# EAGLE design I2C Spilter Board (EAGLE 7.1.0)
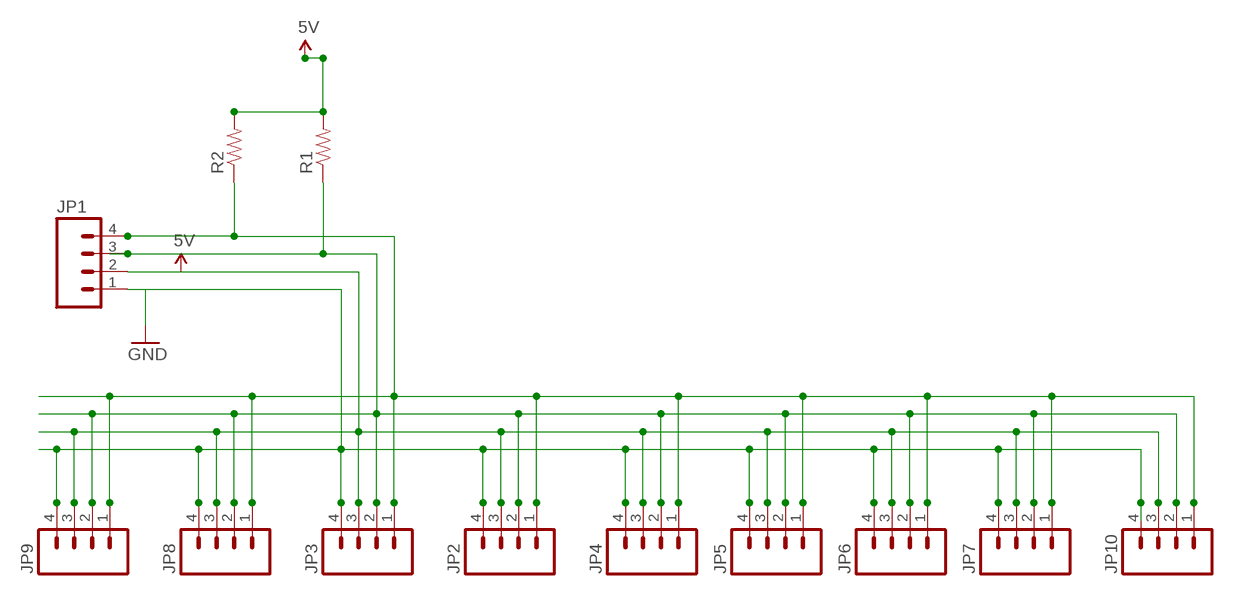
[diagram p0: schematic, sheet 1]

## Parts
JP1  M04PTH  [1X04]
JP2  M04PTH  [1X04]
JP3  M04PTH  [1X04]
JP4  M04PTH  [1X04]
JP5  M04PTH  [1X04]
JP6  M04PTH  [1X04]
JP7  M04PTH  [1X04]
JP8  M04PTH  [1X04]
JP9  M04PTH  [1X04]
JP10  M04PTH  [1X04]
R1  RESISTORAXIAL-0.3  [AXIAL-0.3]
R2  RESISTORAXIAL-0.3  [AXIAL-0.3]

## Nets
5V: JP1.2 JP2.3 JP3.3 JP4.3 JP5.3 JP6.3 JP7.3 JP8.3 JP9.3 JP10.3 R1.P$2 R2.P$2
GND: JP1.1 JP2.4 JP3.4 JP4.4 JP5.4 JP6.4 JP7.4 JP8.4 JP9.4 JP10.4
N$19: JP1.3 JP2.2 JP3.2 JP4.2 JP5.2 JP6.2 JP7.2 JP8.2 JP9.2 JP10.2 R1.P$1
N$20: JP1.4 JP2.1 JP3.1 JP4.1 JP5.1 JP6.1 JP7.1 JP8.1 JP9.1 JP10.1 R2.P$1

## Library data of the parts
JP1-JP10 = SparkFun-Connectors:M04: Header 4 Standard 4-pin 0.1" header. Use with straight break away headers (SKU : PRT-00116), right angle break away headers (PRT-00553), swiss pins (PRT-00743), machine pins (PRT-00117), and female headers (PRT-00115). Molex polarized connector foot print use with SKU : PRT-08231 with associated crimp pins and housings. 1MM SMD Version SKU: PRT-10208
R1 R2 = SparkFun-Passives:RESISTOR: Resistor Basic schematic elements and footprints for 0603, 1206, and PTH resistors.

## Board
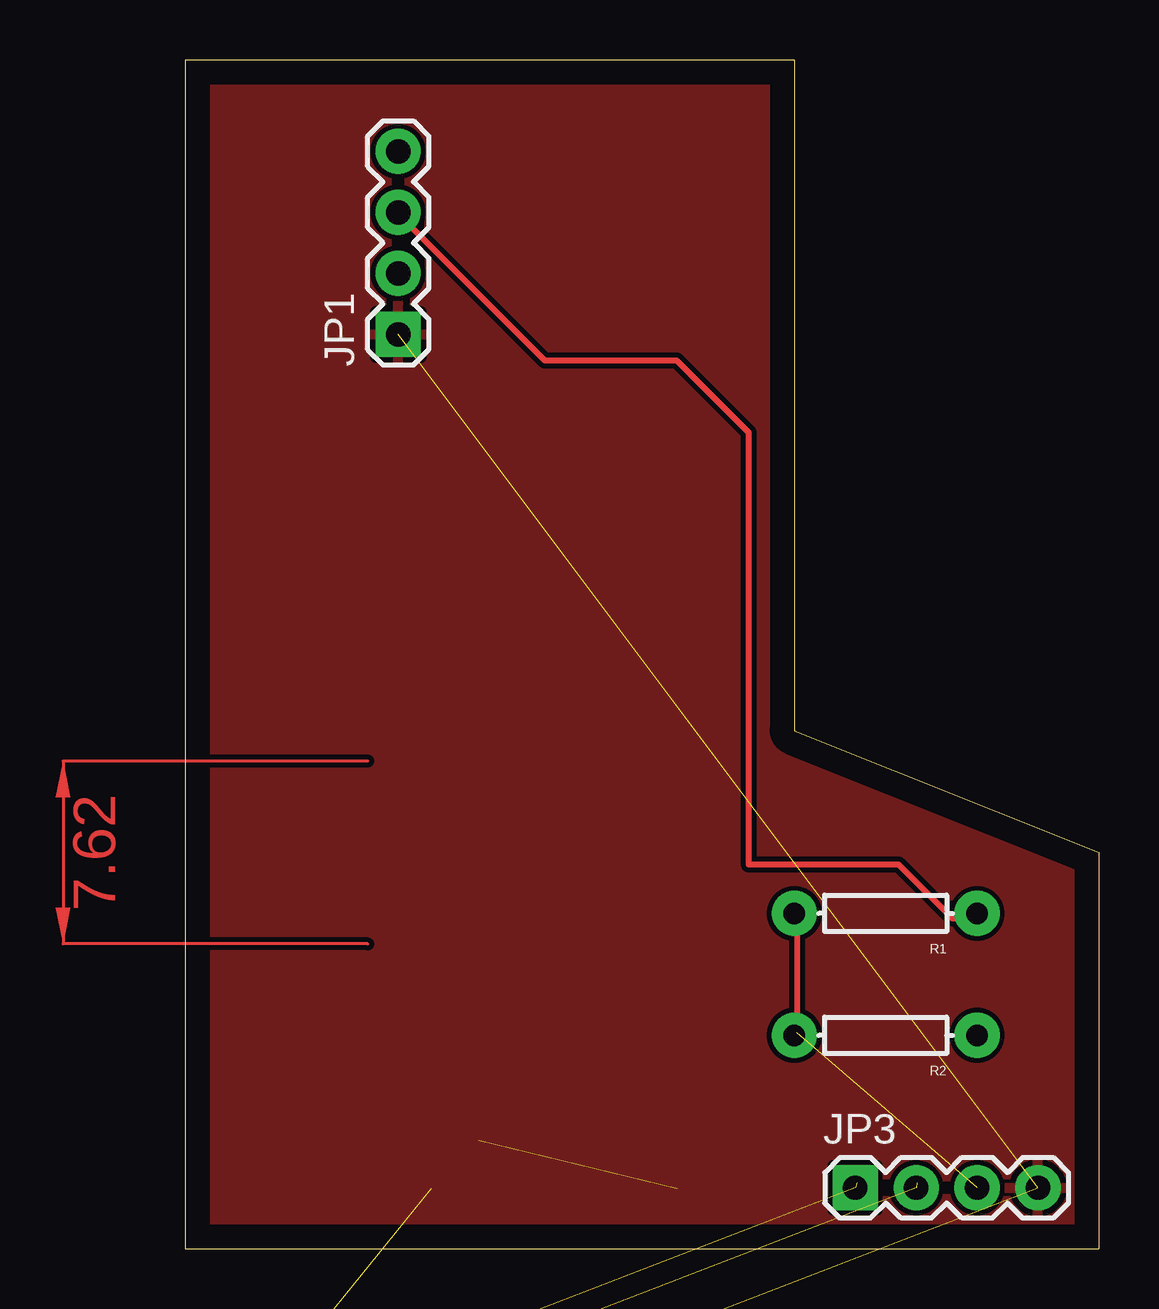
[diagram p1: board, top side]
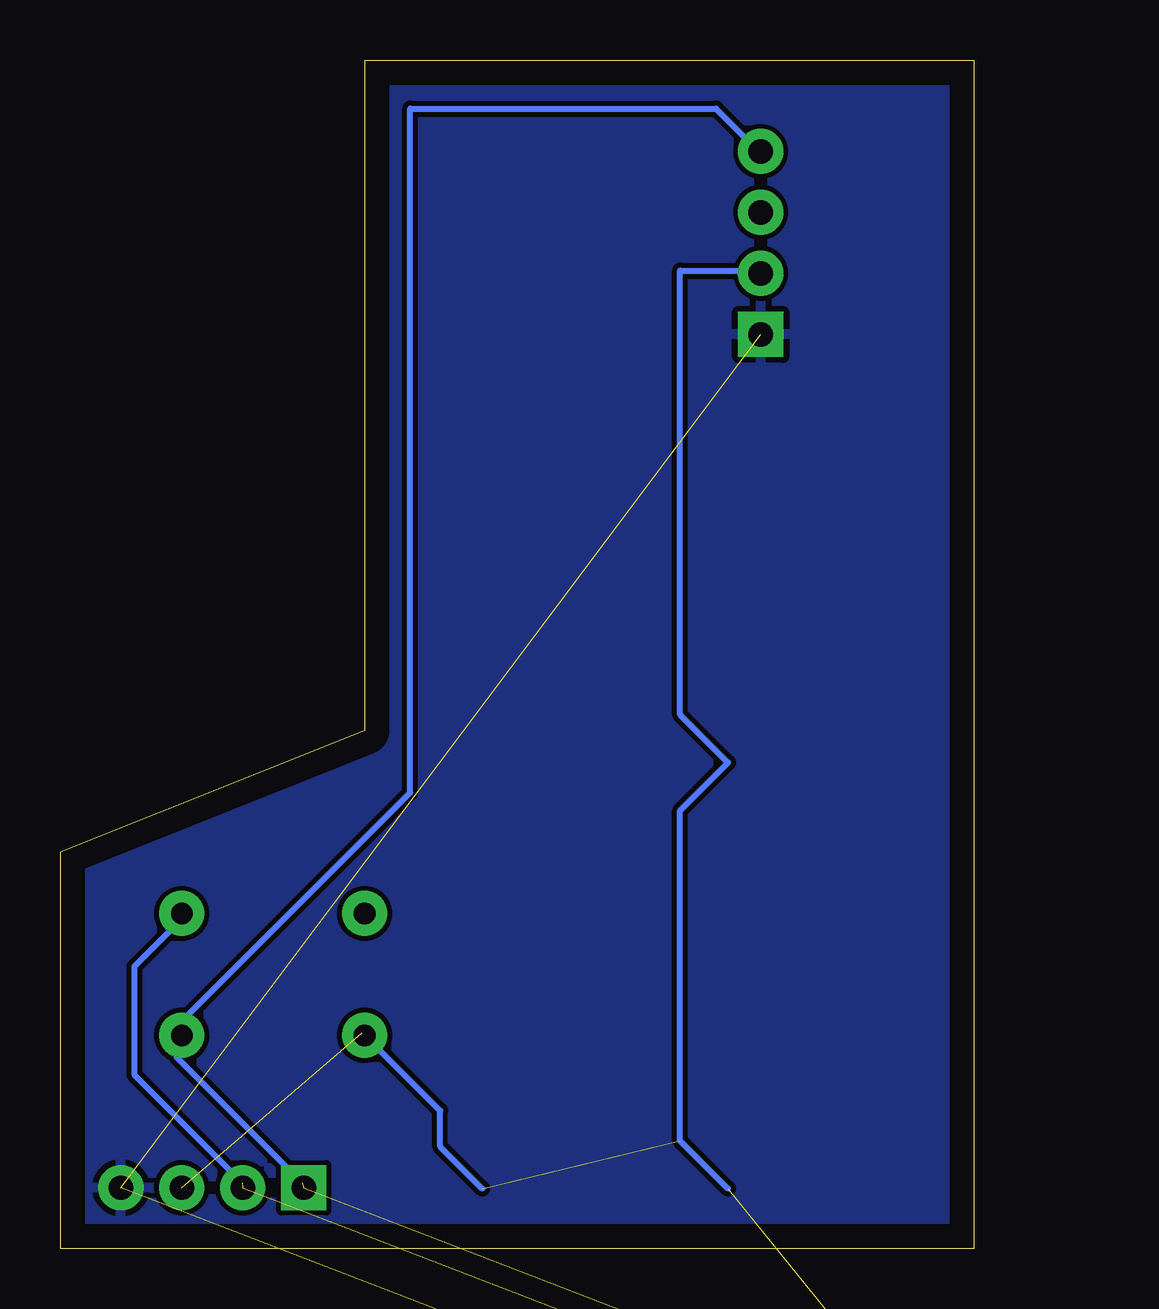
[diagram p2: board, bottom side, seen from below]

Size 38.1 x 49.53 mm. Coordinates in mm from the lower left corner, seen from the top.
Outline: 0,0 38.1,0 38.1,16.51 25.4,21.59 25.4,49.53 0,49.52 0,0
Copper layers (1*16): Top 0.035mm / dielectric 1.5mm / Bottom 0.035mm
Design rules "default": minimum track width 10mil, minimum drill 24mil, track to track 8mil, track to pad 8mil, pad to pad 8mil, via to via 8mil, smd to smd 8mil, copper to edge 40mil, drill to drill 8mil, minimum pad ring 10mil, minimum via ring 8mil, stop-mask expansion 4mil, vias tented up to drill 0mil, thermal gap 10mil

### Footprints (pad centres in the part's own frame; a part is rotated, then mirrored left to right if it is on the bottom)
1X04 = drill 1.016 pad 1.88 square: 1 0,0 | drill 1.016 pad 1.88: 2 2.54,0; 3 5.08,0; 4 7.62,0
AXIAL-0.3 = drill 0.9 pad 1.88: P$1 -3.81,0; P$2 3.81,0

### Placement (x,y rotation side)
JP1  8.89,38.1 90 top
JP2  -5.08,-10.16 0 top  (outside the outline)
JP3  27.94,2.54 0 top
JP4  -5.08,-15.24 0 top  (outside the outline)
JP5  -5.08,-20.32 0 top  (outside the outline)
JP6  -5.08,-25.4 0 top  (outside the outline)
JP7  -5.08,-30.48 0 top  (outside the outline)
JP8  -5.08,-35.56 0 top  (outside the outline)
JP9  -5.08,-40.64 0 top  (outside the outline)
JP10  -5.08,-45.72 0 top  (outside the outline)
R1  29.21,13.97 180 top
R2  29.21,8.89 180 top

### Tracks (layer width: path | path; a pad name or v marks a point on that pad's centre or on a via)
5V  (10 unrouted)
  Top 0.254: R2.P$2 25.5,9 25.5,13.75 R1.P$2
  Bottom 0.254: 10.25,2.5 12.25,4.5 12.25,18.25 10.25,20.25 12.25,22.25 12.25,40.75 9,40.75 JP1.2 | 20.5,2.5 22.25,4.25 22.25,5.75 25.25,8.75 R2.P$2
GND  (9 unrouted)
  pour Bottom: -6.35,53.09 33.02,53.34 46.48,-6.1 -6.86,-6.35
  pour Top: -3.81,51.82 31.75,50.8 45.21,-3.56 -4.32,-3.81
N$19  (9 unrouted)
  Top 0.254: JP1.3 9,43 15,37 20.5,37 23.5,34 23.5,16 29.75,16 32,13.75 33,13.75 R1.P$1
  Bottom 0.254: 30.5,2.75 35,7.25 35,11.75 33.25,13.5 33.25,13.75 R1.P$1
N$20  (9 unrouted)
  Bottom 0.254: 28,2.75 33.25,8 33.25,8.75 R2.P$1 33,9 33,9.5 23.5,19 23.5,47.5 10.75,47.5 9,45.75 JP1.4
(copper drawn outside any net)
  shapes: Top area x1